# EAGLE design ADNS-9800 (EAGLE 6.3)
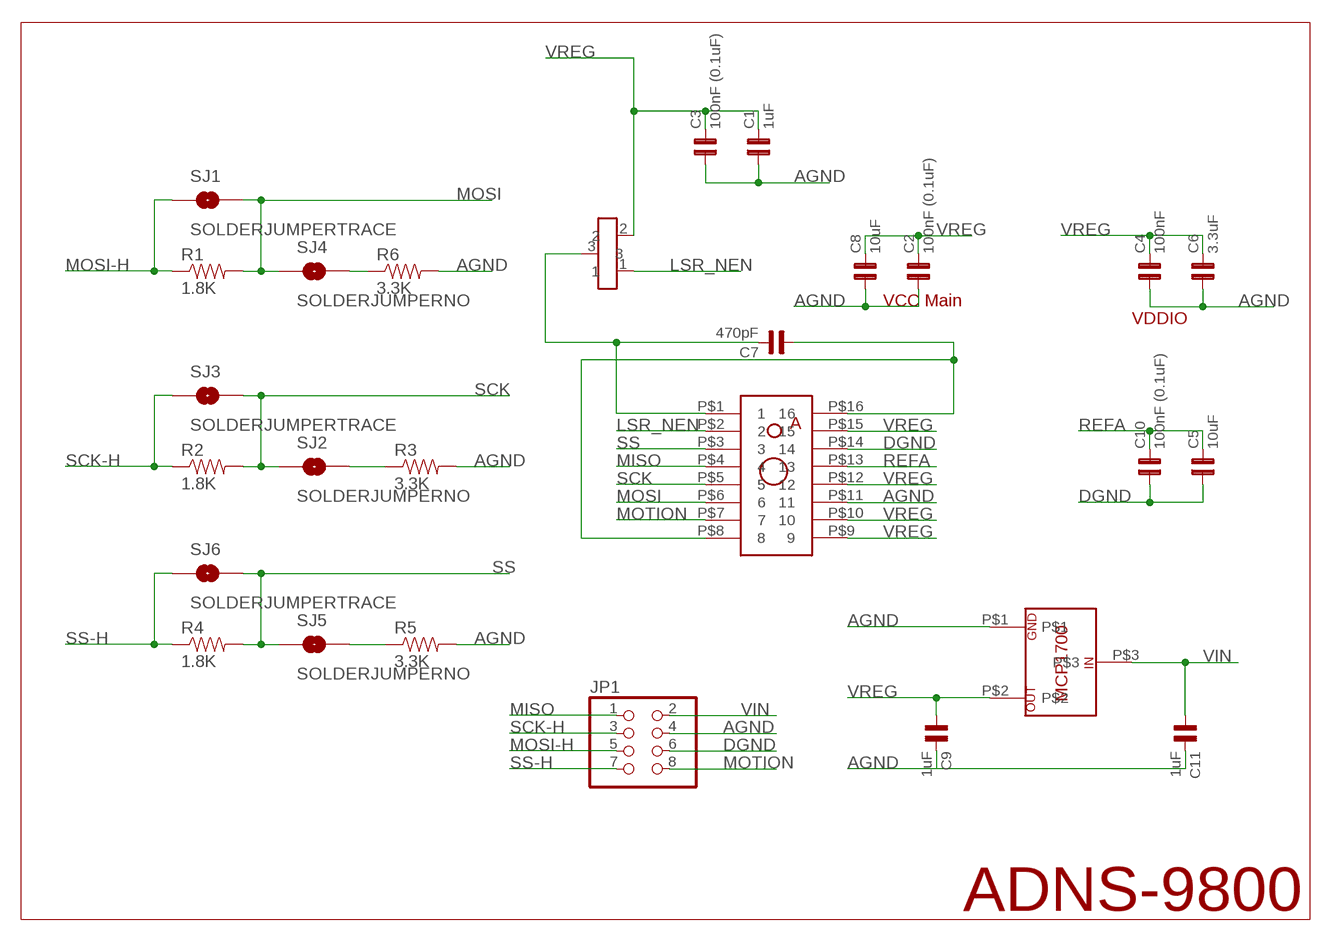
[diagram p0: schematic, sheet 1]

## Parts
C1  1uF  C0603  [0603]
C2  100nF (0.1uF)  C0603  [0603]
C3  100nF (0.1uF)  C0603  [0603]
C4  100nF  C0603  [0603]
C5  10uF  C0603  [0603]
C6  3.3uF  C0603  [0603]
C7  470pF  C0603  [0603]
C8  10uF  C0603  [0603]
C9  1uF  C0603  [0603]
C10  100nF (0.1uF)  C0603  [0603]
C11  1uF  C0603  [0603]
JP1  PINHD-2X4  [2X04]
Q1  TRANSISTOR_SC-75  [SC-75_TRANSISTOR]
R1  1.8K  RESISTOR0603-RES  [0603-RES]
R2  1.8K  RESISTOR0603-RES  [0603-RES]
R3  3.3K  RESISTOR0603-RES  [0603-RES]
R4  1.8K  RESISTOR0603-RES  [0603-RES]
R5  3.3K  RESISTOR0603-RES  [0603-RES]
R6  3.3K  RESISTOR0603-RES  [0603-RES]
SJ1  SOLDERJUMPERTRACE  [SJ_2S-TRACE]
SJ2  SOLDERJUMPERNO  [SJ_2S-NO]
SJ3  SOLDERJUMPERTRACE  [SJ_2S-TRACE]
SJ4  SOLDERJUMPERNO  [SJ_2S-NO]
SJ5  SOLDERJUMPERNO  [SJ_2S-NO]
SJ6  SOLDERJUMPERTRACE  [SJ_2S-TRACE]
U$1  AVAGO_ADNS-9500  [AVAGO_ADNS-9500]
U$2  MCP1700__LDO  [MCP1700__LDO]

## Nets
AGND: C1.1 C2.1 C3.1 C4.1 C6.1 C8.1 C9.2 C11.2 JP1.4 R3.2 R5.2 R6.2 U$1.P$11 U$2.P$1
DGND: C5.1 C10.1 JP1.6 U$1.P$14
LSR_NEN: Q1.1 U$1.P$2
MISO: JP1.1 U$1.P$4
MOSI: R1.2 SJ1.2 SJ4.1 U$1.P$6
MOSI-H: JP1.5 R1.1 SJ1.1
MOTION: JP1.8 U$1.P$7
N$1: C7.1 U$1.P$8 U$1.P$16
N$2: C7.2 Q1.3 U$1.P$1
N$9: R6.1 SJ4.2
N$11: R3.1 SJ2.2
N$15: R5.1 SJ5.2
REFA: C5.2 C10.2 U$1.P$13
SCK: R2.2 SJ2.1 SJ3.2 U$1.P$5
SCK-H: JP1.3 R2.1 SJ3.1
SS: R4.2 SJ5.1 SJ6.2 U$1.P$3
SS-H: JP1.7 R4.1 SJ6.1
VIN: C11.1 JP1.2 U$2.P$3
VREG: C1.2 C2.2 C3.2 C4.2 C6.2 C8.2 C9.1 Q1.2 U$1.P$9 U$1.P$10 U$1.P$12 U$1.P$15 U$2.P$2

## Notes on the sheet
- VCC Main
- VDDIO
- ADNS-9800

## Library data of the parts
C1-C11 = capsmd:C0603
JP1 = pinhead:PINHD-2X4: PIN HEADER
Q1 = JKCustom:TRANSISTOR_SC-75: SC-75 Package
R1-R6 = SparkFun-Passives:RESISTOR: Resistor Basic schematic elements and footprints for 0603, 1206, and PTH resistors.
SJ1-SJ6 = SparkFun-Passives:SOLDERJUMPER: Solder Jumper Standard SMD solder jumper. Used to automate production. Two varients : Normally Open and Normally Closed are the same, but have different paste layers. NC will have a large amount of paste and should jumper during reflow.
U$1 = JKCustom:AVAGO_ADNS-9500
U$2 = JKCustom:MCP1700__LDO

## Board
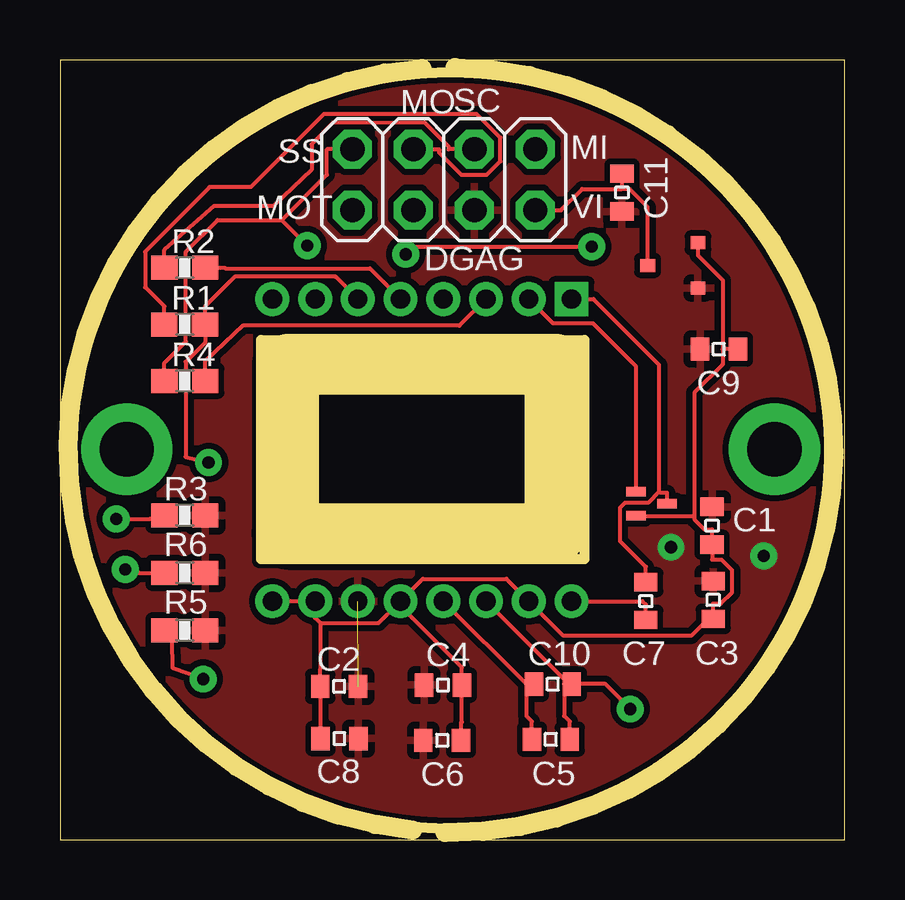
[diagram p1: board, top side]
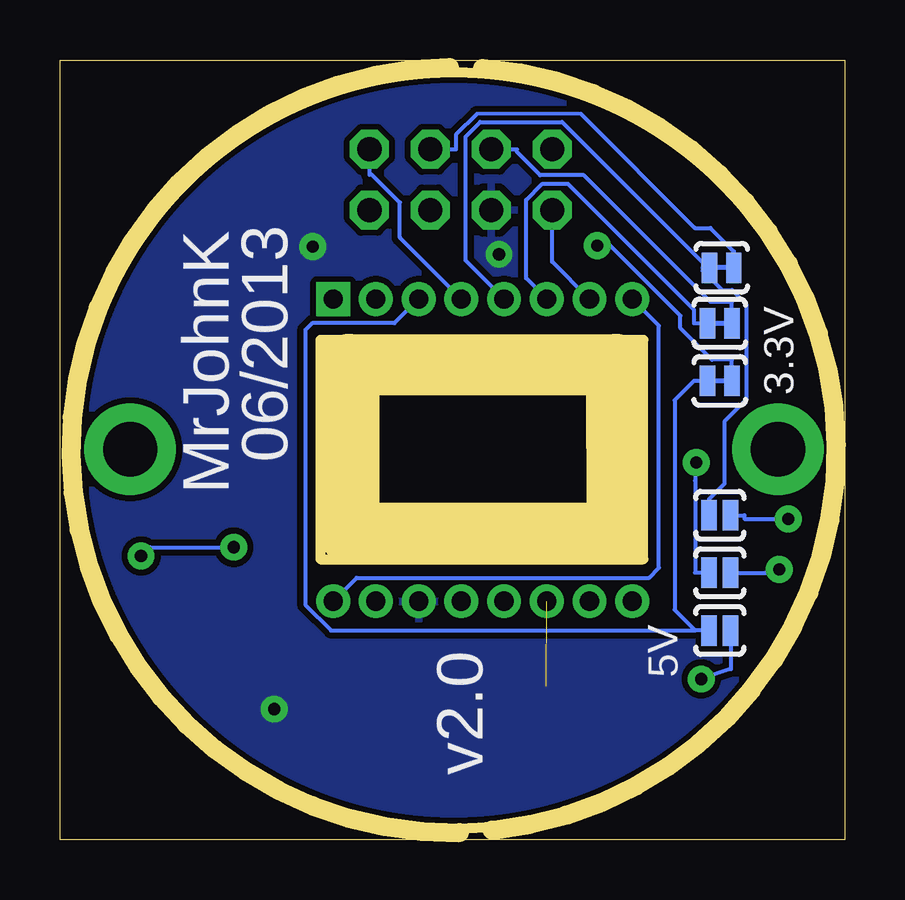
[diagram p2: board, bottom side, seen from below]

Size 32.69 x 32.5 mm. Coordinates in mm from the lower left corner, seen from the top.
Outline: 0,0 32.69,0 32.69,32.5 0,32.5 0,0
Outline: 9.52,19.81 9.5,12.76 20.63,12.76 20.64,19.81 9.52,19.81
Outline: circle at 16.29,16.23 radius 15.76
Copper layers (1*16): Top 0.035mm / dielectric 1.5mm / Bottom 0.035mm
Design rules "default *": minimum track width 12mil, minimum drill 0.7938mm, track to track 10mil, track to pad 10mil, pad to pad 10mil, via to via 10mil, smd to smd 10mil, copper to edge 10mil, drill to drill 10mil, minimum pad ring 12mil, minimum via ring 12mil, stop-mask expansion 12mil, vias tented up to drill 0mil, thermal gap 12mil
tRestrict: area 8.1,11.4 to 22.1,21.1; area 0.2,14.4 to 4.6,18.2; area 27.9,14.4 to 31.7,18.1
bRestrict: area 0.2,14.4 to 4.6,18.2; area 27.9,14.4 to 31.6,18.2; 4 lines
Milling: 6 lines

### Footprints (pad centres in the part's own frame; a part is rotated, then mirrored left to right if it is on the bottom)
0603 = smd 0.762 x 0.965: 1 -0.787,0; 2 0.787,0
2X04 = drill 1.016 octagon: 1 -3.81,-1.27; 2 -3.81,1.27; 3 -1.27,-1.27; 4 -1.27,1.27; 5 1.27,-1.27; 6 1.27,1.27; 7 3.81,-1.27; 8 3.81,1.27
SC-75_TRANSISTOR = smd 0.406 x 0.813: 1 0.2,0.4; 2 1.2,0.4; 3 0.7,1.7
0603-RES = smd 1.1 x 1: 1 -0.85,0; 2 0.85,0
SJ_2S-TRACE = smd 0.635 x 1.27: 1 -0.508,0; 2 0.508,0
SJ_2S-NO = smd 0.635 x 1.27: 1 -0.45,0; 2 0.45,0
AVAGO_ADNS-9500 = drill 0.8 pad 1.3 square: P$1 0,0 | drill 0.8 pad 1.3: P$2 -1.78,0; P$3 -3.56,0; P$4 -5.34,0; P$5 -7.12,0; P$6 -8.9,0; P$7 -10.68,0; P$8 -12.46,0; P$9 -12.46,-12.6; P$10 -10.68,-12.6; P$11 -8.9,-12.6; P$12 -7.12,-12.6; P$13 -5.34,-12.6; P$14 -3.56,-12.6; P$15 -1.78,-12.6; P$16 0,-12.6
MCP1700__LDO = smd 0.54 x 0.62: P$1 0,0; P$2 1.9,0; P$3 0.95,2.1

### Placement (x,y rotation side)
C1  27.17,13.09 270 top
C2  11.63,6.39 180 top
C3  27.22,9.99 270 top
C4  15.96,6.44 0 top
C5  20.45,4.18 180 top
C6  15.92,4.14 0 top
C7  24.41,9.95 90 top
C8  11.65,4.21 180 top
C9  27.46,20.44 180 top
C10  20.54,6.48 180 top
C11  23.41,26.97 270 top
JP1  15.99,27.51 180 top
Q1  23.59,14.7 270 top
R1  5.2,21.48 0 top
R2  5.2,23.84 0 top
R3  5.2,13.52 0 top
R4  5.2,19.12 0 top
R5  5.2,8.72 0 top
R6  5.2,11.12 0 top
SJ1  5.2,21.52 180 bottom
SJ2  5.2,13.52 0 bottom
SJ3  5.12,23.84 180 bottom
SJ4  5.2,11.12 0 bottom
SJ5  5.2,8.72 0 bottom
SJ6  5.2,19.12 180 bottom
U$1  21.31,22.54 0 top
U$2  26.58,22.99 90 top

### Tracks (layer width: path | path; a pad name or v marks a point on that pad's centre or on a via)
AGND  (via drill 0.51 pad 1.02)  (1 unrouted)
  Bottom 0.17: v29.32,11.82 28.95,12.19 v25.46,12.19
  pour Top: 0,0 0,33.02 33.02,33.02 33.02,0
DGND  (via drill 0.51 pad 1.02)
  Top 0.17: U$1.P$14 21.01,6.68 21.01,6.48 | C5.1 21.24,4.92 21.01,5.16 21.01,6.48 | 21.01,6.48 C10.1 22.72,6.48 v23.76,5.44 | v14.4,24.4 14.72,24.72 v22.16,24.72
  pour Bottom: 0,0 0,33.02 33.02,33.02 33.02,0
LSR_NEN
  Top 0.17: U$1.P$2 20.54,21.53 22.21,21.53 23.99,19.74 Q1.1
MISO
  Bottom 0.17: JP1.1 19.8,27.71 19.69,27.71 18.53,26.55 18.53,25.1 U$1.P$4
MOSI  (via drill 0.51 pad 1.02)
  Top 0.17: U$1.P$6 11.48,23.46 7.28,23.46 6.05,22.23 R1.2 6.05,20.72 5.24,19.92 5.24,15.95 v6.19,15.72
  Bottom 0.17: SJ1.2 6.28,21.52 6.28,22.09 11.53,27.34 12.6,27.34 13.27,26.66 13.27,23.4 U$1.P$6 | SJ4.1 6.23,11.12 6.23,14.97 v6.19,15.72
MOSI-H
  Top 0.17: R1.1 4.35,22.23 3.55,23.03 3.55,24.51 6.24,27.2 7.95,27.2 10.99,30.24 17.36,30.25 18.34,29.26 18.34,28.28 17.78,27.71 16.73,27.71 15.79,28.65 15.79,28.78 JP1.5
  Bottom 0.17: JP1.5 13.66,28.78 13.66,28.67 12.68,27.7 10.87,27.7 5.58,22.41 4.69,22.41 SJ1.1
MOTION
  Bottom 0.17: U$1.P$7 12.18,24.09 JP1.8
N$1
  Top 0.17: U$1.P$16 24.27,9.94 24.41,9.8 C7.1
  Bottom 0.17: U$1.P$16 20.33,10.92 8.15,10.92 7.74,11.33 7.74,21.43 U$1.P$8
N$2
  Top 0.17: Q1.3 25.29,14.46 25.01,14.46 24.97,14.5 | 24.97,14.5 24.97,19.79 22.22,22.54 U$1.P$1 | 24.97,14.5 24.51,14.04 23.54,14.04 23.33,13.84 23.33,12.45 24.41,11.37 C7.2
N$5  (via drill 2.26 pad 3.81)
  other vias: 29.77,16.27
N$6  (via drill 2.26 pad 3.81)
  other vias: 2.78,16.27
N$9  (via drill 0.51 pad 1.02)
  Top 0.17: v2.72,11.26 3.3,11.12 R6.1
  Bottom 0.17: SJ4.2 3.3,11.12 v2.72,11.26
N$11  (via drill 0.51 pad 1.02)
  Top 0.17: R3.1 4.19,13.41 3.76,13.37 v2.35,13.37
  Bottom 0.17: SJ2.2 4.18,13.52 4.18,13.37 v2.35,13.37
N$15  (via drill 0.51 pad 1.02)
  Top 0.17: R5.1 4.67,8.32 4.7,7.15 v5.97,6.69
  Bottom 0.17: SJ5.2 4.74,7.12 v5.97,6.69
REFA
  Top 0.17: U$1.P$13 19.42,6.48 19.43,6.48 | C5.2 19.67,4.92 19.43,5.16 19.43,6.48 | C10.2 19.43,6.48
SCK
  Top 0.17: R2.2 6.86,23.84 6.89,23.81 12.92,23.81 U$1.P$5
  Bottom 0.17: U$1.P$5 15.8,24.14 15.8,29.3 15.19,29.91 11.77,29.91 5.92,24.06 5.92,23.84 | 5.92,23.84 5.92,23.72 5.11,22.91 4.68,22.91 4.1,22.33 4.1,18.34 5.01,17.43 5.01,14.83 5.65,14.19 SJ2.1 | SJ3.2 5.92,23.84
SCK-H
  Top 0.17: JP1.3 16.2,28.78 16.2,28.89 15.2,29.89 11.39,29.9 10.48,28.99 10.48,27.92 8.88,26.4 6.4,26.4 4.35,24.6 R2.1
  Bottom 0.17: JP1.3 16.2,28.78 16.2,29.38 15.33,30.25 10.99,30.26 6.23,25.5 5.59,25.5 4.61,24.52 SJ3.1 | SJ3.1
SS
  Top 0.17: R4.2 6.05,19.96 7.61,21.43 16.64,21.43 U$1.P$3
  Bottom 0.17: U$1.P$3 18.76,21.53 22.19,21.53 22.47,21.25 22.47,9.79 21.4,8.72 6.23,8.72 | SJ5.1 6.23,8.72 | SJ6.2 6.28,19.12 7.09,18.32 7.09,9.58 6.23,8.72
SS-H  (via drill 0.51 pad 1.02)
  Top 0.17: 9.24,25.83 11.12,27.71 11.12,28.78 JP1.7 | 9.24,25.83 6.57,25.83 5.24,24.51 5.24,20.76 4.35,19.88 R4.1 | 9.24,25.83 v10.31,24.76
  Bottom 0.17: v10.31,24.76 9.77,24.76 6.84,21.84 6.84,21.32 5.54,20.01 4.69,20.01 SJ6.1
VIN
  Top 0.17: JP1.2 20.87,26.24 21.76,27.13 23.41,27.13 | C11.1 23.41,27.13 | U$2.P$3 24.48,26.38 23.73,27.13 23.41,27.13
VREG
  Top 0.17: 26.43,13.5 26.43,13.35 26.85,12.93 27.17,12.93 C1.2 27.17,11.66 27.56,11.66 28,11.23 28,10.3 27.54,9.84 27.22,9.84 27.22,9.41 | 27.61,20.44 27.61,19.81 26.43,18.63 26.43,13.5 | Q1.2 26.43,13.5 | 14.09,9.84 U$1.P$12 15.12,10.87 18.6,10.87 U$1.P$15 20.97,8.49 26.3,8.49 27.22,9.41 | 10.85,9.02 13.28,9.02 14.09,9.84 | 14.09,9.84 16.74,7.18 C4.2 16.74,4.91 16.71,4.87 C6.2 | 10.85,9.02 10.63,9.24 U$1.P$10 U$1.P$9 | 10.85,9.02 10.85,7.12 C2.2 10.85,4.96 10.86,4.95 C8.2 | U$2.P$2 26.58,24.36 27.61,23.34 27.61,20.44 | C3.2 27.22,9.41 | C9.1 27.61,20.44

### Text on the board
_tsilk: MO | SC | SS | MI | MOT | VI | DG | AG
_bsilk: 06/2013 | MrJohnK | 3.3V | v2.0 | 5V